# EAGLE schematic Conection (EAGLE 9.6.2)
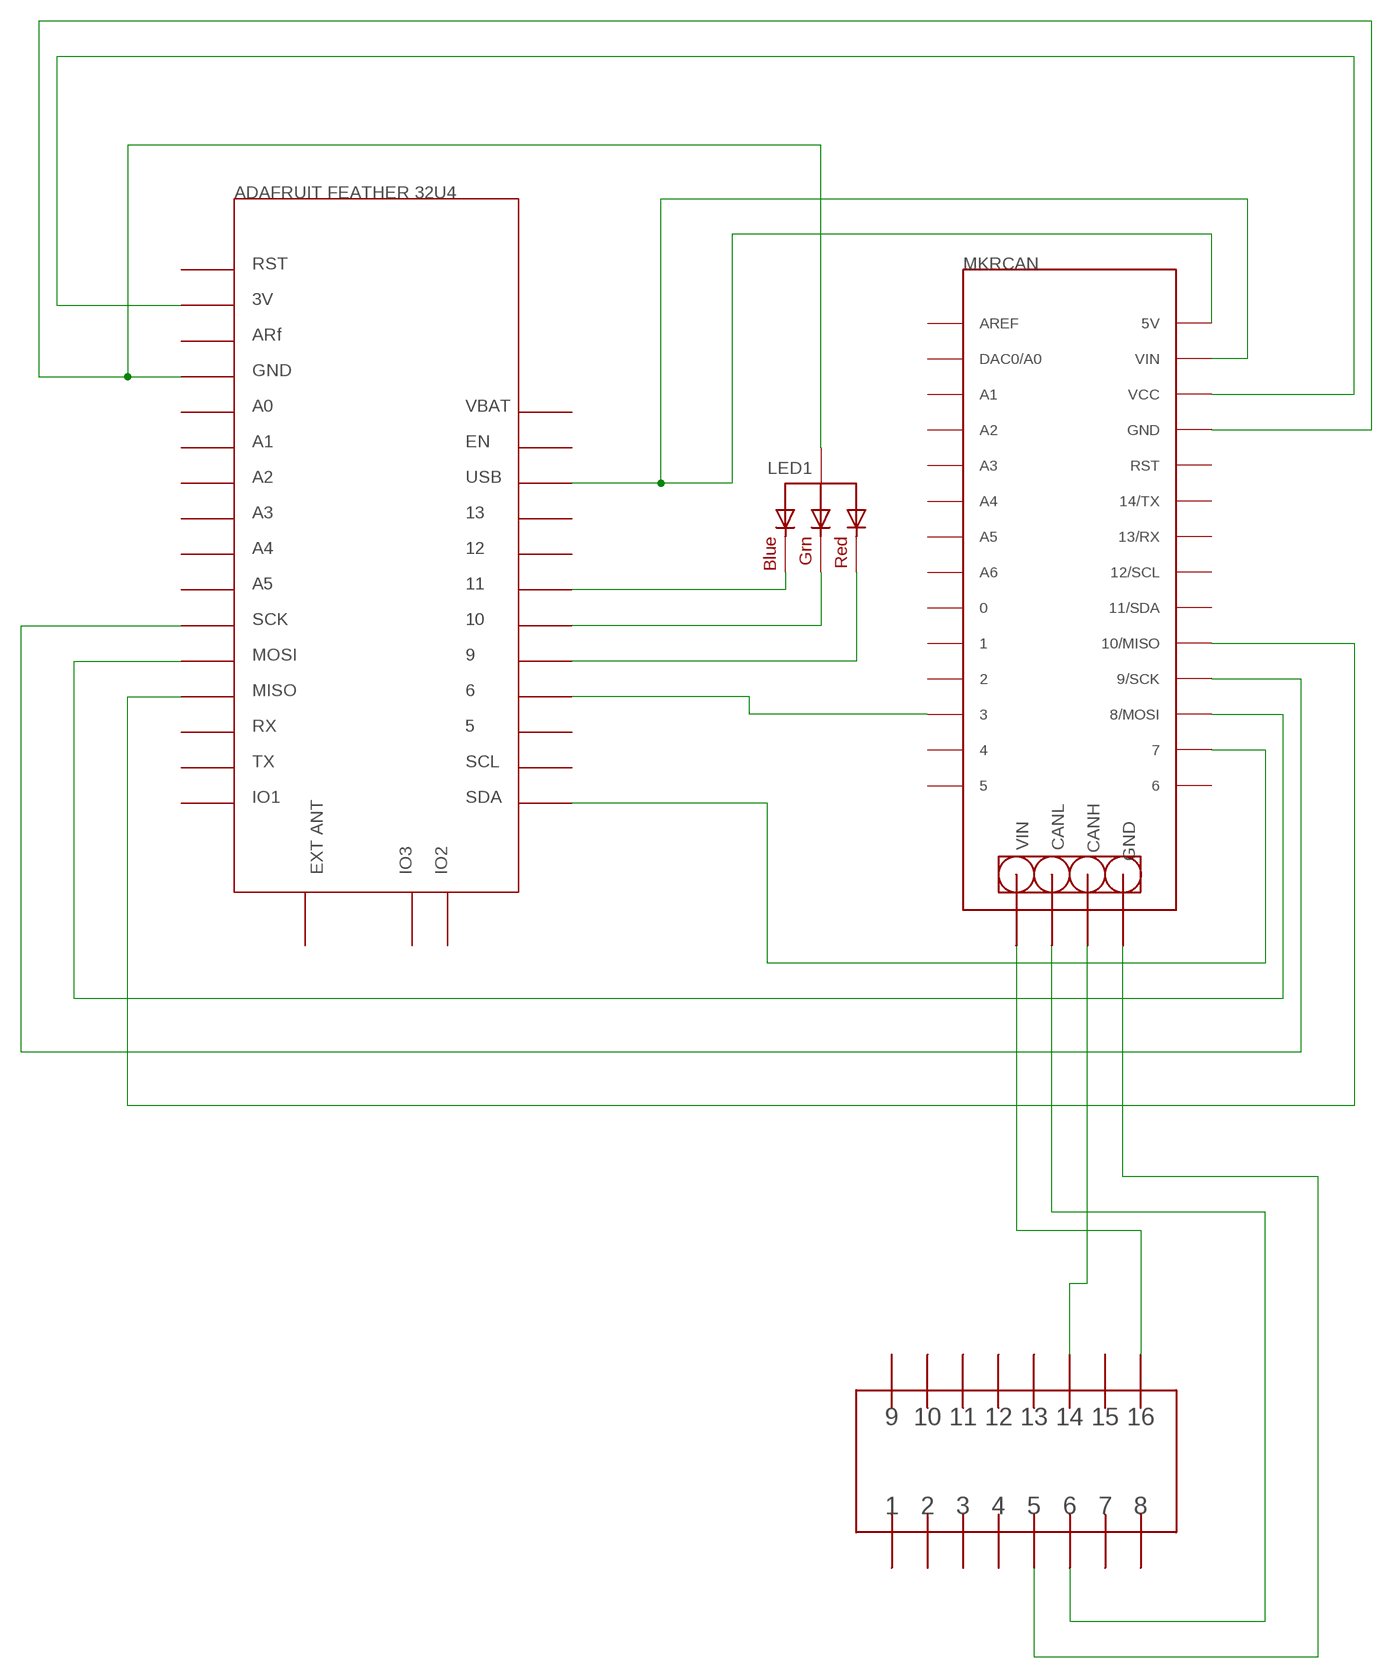
[diagram p0: schematic, sheet 1]

## Parts
LED1  RGBLED_CA-5MM  [LED5MMRGB]
MKRCAN  -  ARDUINO-UTILITY_MKRBOARD  [ARDUINO-UTILITY_MKRBOARD-NH]

## Nets
N$1: MKRCAN.3
N$2: MKRCAN.7
N$3: MKRCAN.8(8/MOSI)
N$4: MKRCAN.9(9/SCK)
N$5: MKRCAN.10(10/MISO)
N$6: MKRCAN.VCC
N$7: MKRCAN.5V MKRCAN.VIN
N$8: LED1.2(VCC) MKRCAN.GND
N$9: LED1.1(RED)
N$10: LED1.3(GREEN)
N$11: LED1.4(BLUE)
Unconnected: MKRCAN.0 MKRCAN.1 MKRCAN.2 MKRCAN.4 MKRCAN.5 MKRCAN.6 MKRCAN.11(11/SDA) MKRCAN.12(12/SCL) MKRCAN.13(13/RX) MKRCAN.14(14/TX) MKRCAN.A0(DAC0/A0) MKRCAN.A1 MKRCAN.A2 MKRCAN.A3 MKRCAN.A4 MKRCAN.A5 MKRCAN.A6 MKRCAN.AREF MKRCAN.RST

## Notes on the sheet
- ADAFRUIT FEATHER 32U4
- RST
- 3V
- ARf
- GND
- A0 | VBAT
- A1 | EN
- A2 | USB
- A3 | 13
- A4 | 12
- A5 | 11
- SCK | 10
- MOSI | 9
- MISO | 6
- RX | 5
- TX | SCL
- IO1 | SDA
- EXT ANT | IO3 | IO2
- 9 | 10 | 11 | 12 | 13 | 14 | 15 | 16
- 1 | 2 | 3 | 4 | 5 | 6 | 7 | 8

## Library data of the parts
LED1 = adafruit:RGBLED_CA: RGB LED, common-anode 5MM Staggered pins 5mm Piranha package http://www.ladyada.net/library/pcb/eaglelibrary.html
MKRCAN = MKRcan:ARDUINO-UTILITY_MKRBOARD: MKR board footprint; CODE-ARDUINO: A5272 A5273; DATASHEET: -; DISTRIBUTOR-LINK: -; DISTRIBUTOR-PN: -; MANUFACTURER: -; MANUFACTURER-PN: 21TW331 21TW332; RESTRICTIONS: NO